# Altium schematic sheet Cover.SCHDOC: FPGA Rack
size 420 x 297 mm; DrawnBy: zas; Revision: V1.0; SheetNumber: 1; SheetTotal: 25; DocumentName: Cover.SCHDOC
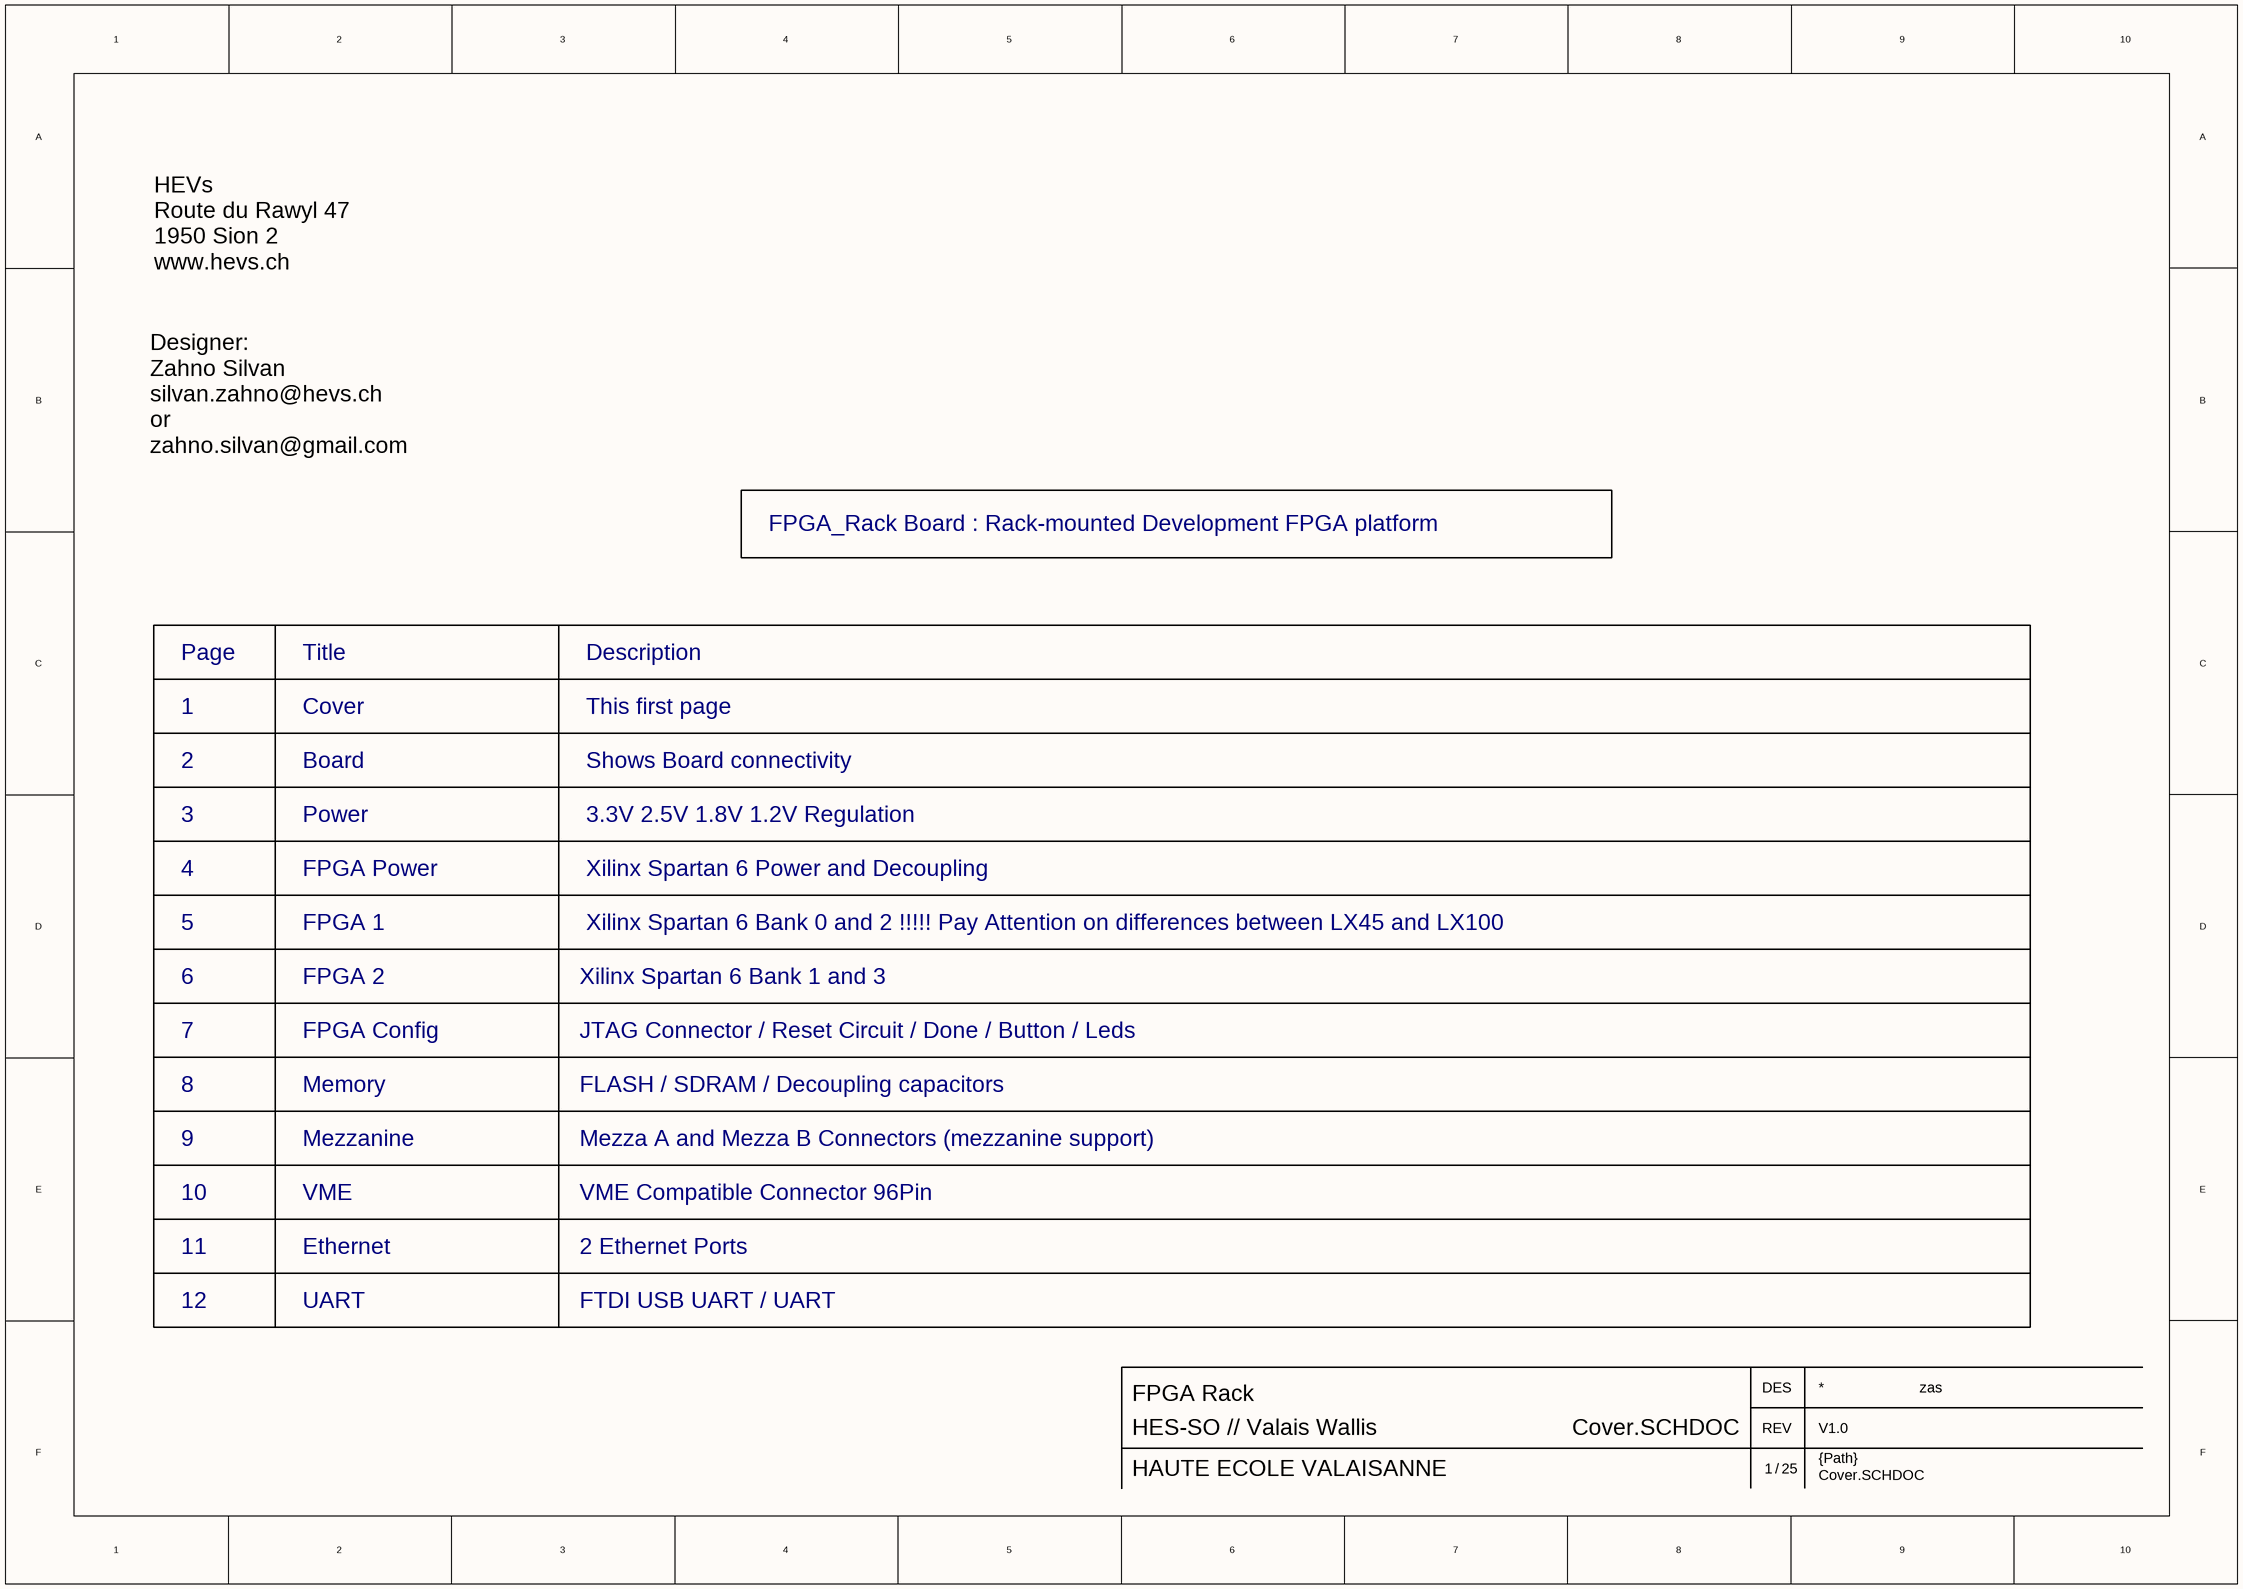
[diagram p0: Cover.SCHDOC]

## Notes on the sheet
- HEVs
  Route du Rawyl 47
  1950 Sion 2
  www.hevs.ch
- Designer:
  Zahno Silvan
  silvan.zahno@hevs.ch
  or
  zahno.silvan@gmail.com
- FPGA_Rack Board : Rack-mounted Development FPGA platform
- Page
- Title
- Description
- 1
- Cover
- This first page
- 2
- Board
- Shows Board connectivity
- 4
- 3
- FPGA Power
- Power
- Xilinx Spartan 6 Power and Decoupling
- 3.3V 2.5V 1.8V 1.2V Regulation
- 5
- FPGA 1
- Xilinx Spartan 6 Bank 0 and 2 !!!!! Pay Attention on differences between LX45 and LX100
- 6
- FPGA 2
- Xilinx Spartan 6 Bank 1 and 3
- 7
- FPGA Config
- JTAG Connector / Reset Circuit / Done / Button / Leds
- 9
- 8
- Mezzanine
- Memory
- Mezza A and Mezza B Connectors (mezzanine support)
- FLASH / SDRAM / Decoupling capacitors
- 10
- VME
- VME Compatible Connector 96Pin
- 11
- Ethernet
- 2 Ethernet Ports
- 12
- UART
- FTDI USB UART / UART
- DES
- HES-SO // Valais Wallis
- HAUTE ECOLE VALAISANNE
- /
- REV
- {Path}